# EAGLE design SERVOS-2 (EAGLE 7.2.0)
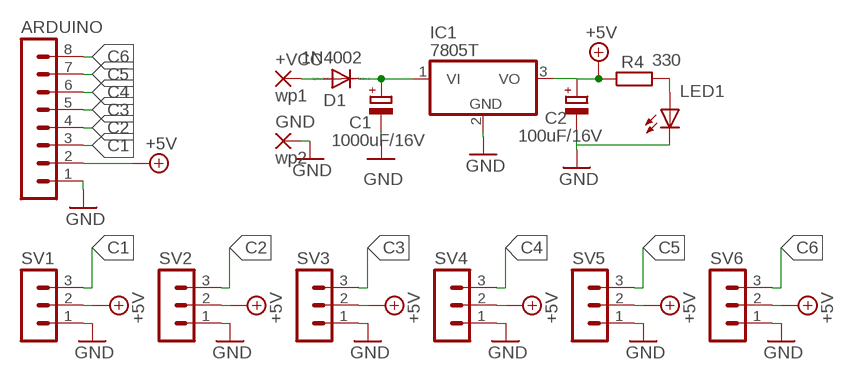
[diagram p0: schematic, sheet 1]

## Parts
+VCC  wp1  WIREPAD1,6/0,9  [1,6/0,9]
ARDUINO  MA08-1  [MA08-1]
C1  1000uF/16V  CPOL-EUE2.5-7  [E2,5-7]
C2  100uF/16V  CPOL-EUE2.5-5  [E2,5-5]
D1  1N4002  1N4148DO35-7  [DO35-7]
GND  wp2  WIREPAD1,6/0,9  [1,6/0,9]
IC1  7805T  [TO220H]
LED1  LED3MM  [LED3MM]
R4  330  R-EU_0207/10  [0207/10]
SV1  MA03-1  [MA03-1]
SV2  MA03-1  [MA03-1]
SV3  MA03-1  [MA03-1]
SV4  MA03-1  [MA03-1]
SV5  MA03-1  [MA03-1]
SV6  MA03-1  [MA03-1]

## Nets
+5V: ARDUINO.2 C2.+ IC1.3(VO) R4.1 SV1.2 SV2.2 SV3.2 SV4.2 SV5.2 SV6.2
C1: ARDUINO.3 SV1.3
C2: ARDUINO.4 SV2.3
C3: ARDUINO.5 SV3.3
C4: ARDUINO.6 SV4.3
C5: ARDUINO.7 SV5.3
C6: ARDUINO.8 SV6.3
GND: ARDUINO.1 C1.- C2.- GND.1(P) IC1.2(GND) LED1.K(C) SV1.1 SV2.1 SV3.1 SV4.1 SV5.1 SV6.1
N$1: C1.+ D1.C IC1.1(VI)
N$2: +VCC.1(P) D1.A
N$3: LED1.A R4.2

## Library data of the parts
+VCC GND = wirepad:WIREPAD: Wire PAD connect wire on PCB
ARDUINO = con-lstb:MA08-1: PIN HEADER; OC_FARNELL: unknown; OC_NEWARK: unknown
C1 C2 = rcl:CPOL-EU: POLARIZED CAPACITOR, European symbol
D1 = diode:1N4148: DIODE high speed (Philips)
IC1 = linear:78*: Positive VOLTAGE REGULATOR Source: http://cache.national.com/ds/LM/LM78L05.pdf http://www.fairchildsemi.com/ds/LM/LM7805.pdf
LED1 = led:LED: LED OSRAM: - CHIPLED LG R971, LG N971, LY N971, LG Q971, LY Q971, LO R971, LY R971 LH N974, LH R974 LS Q976, LO Q976, LY Q976 LO Q996 - Hyper CHIPLED LW Q18S LB Q993, LB Q99A, LB R99A - SideLED LS A670, LO A670, LY A670, LG A670, LP A670 LB A673, LV A673, LT A673, LW A673 LH A674 LY A675 LS A676, LA A676, LO A676, LY A676, LW A676 LS A679, LY A679, LG A679 - Hyper Micro SIDELED® LS Y876, LA Y876, LO Y876, LY Y876 LT Y87S - SmartLED LW L88C, LW L88S LB L89C, LB L89S, LG L890 LS L89K, LO L89K, LY L89K LS L896, LA L896, LO L896, LY L896 - TOPLED LS T670, LO T670, LY T670, LG T670, LP T670 LSG T670, LSP T670, LSY T670, LOP T670, LYG T670 LG T671, LOG T671, LSG T671 LB T673, LV T673, LT T673, LW T673 LH T674 LS T676, LA T676, LO T676, LY T676, LB T676, LH T676, LSB T676, LW T676 LB T67C, LV T67C, LT T67C, LS T67K, LO T67K, LY T67K, LW E67C LS E67B, LA E67B, LO E67B, LY E67B, LB E67C, LV E67C, LT E67C LW T67C LS T679, LY T679, LG T679 LS T770, LO T770, LY T770, LG T770, LP T770 LB T773, LV T773, LT T773, LW T773 LH T774 LS E675, LA E675, LY E675, LS T675 LS T776, LA T776, LO T776, LY T776, LB T776 LHGB T686 LT T68C, LB T68C - Hyper Mini TOPLED® LB M676 - Mini TOPLED Santana® LG M470 LS M47K, LO M47K, LY M47K Source: http://www.osram.convergy.de LUXEON: - LUMILED® LXK2-PW12-R00, LXK2-PW12-S00, LXK2-PW14-U00, LXK2-PW14-V00 LXK2-PM12-R00, LXK2-PM12-S00, LXK2-PM14-U00 LXK2-PE12-Q00, LXK2-PE12-R00, LXK2-PE12-S00, LXK2-PE14-T00, LXK2-PE14-U00 LXK2-PB12-K00, LXK2-PB12-L00, LXK2-PB12-M00, LXK2-PB14-N00, LXK2-PB14-P00, LXK2-PB14-Q00 LXK2-PR12-L00, LXK2-PR12-M00, LXK2-PR14-Q00, LXK2-PR14-R00 LXK2-PD12-Q00, LXK2-PD12-R00, LXK2-PD12-S00 LXK2-PH12-R00, LXK2-PH12-S00 LXK2-PL12-P00, LXK2-PL12-Q00, LXK2-PL12-R00 Source: www.luxeon.com KINGBRIGHT: KA-3528ASYC Source: www.kingbright.com
R4 = rcl:R-EU_: RESISTOR, European symbol
SV1-SV6 = con-lstb:MA03-1: PIN HEADER; OC_FARNELL: unknown; OC_NEWARK: unknown

## Board
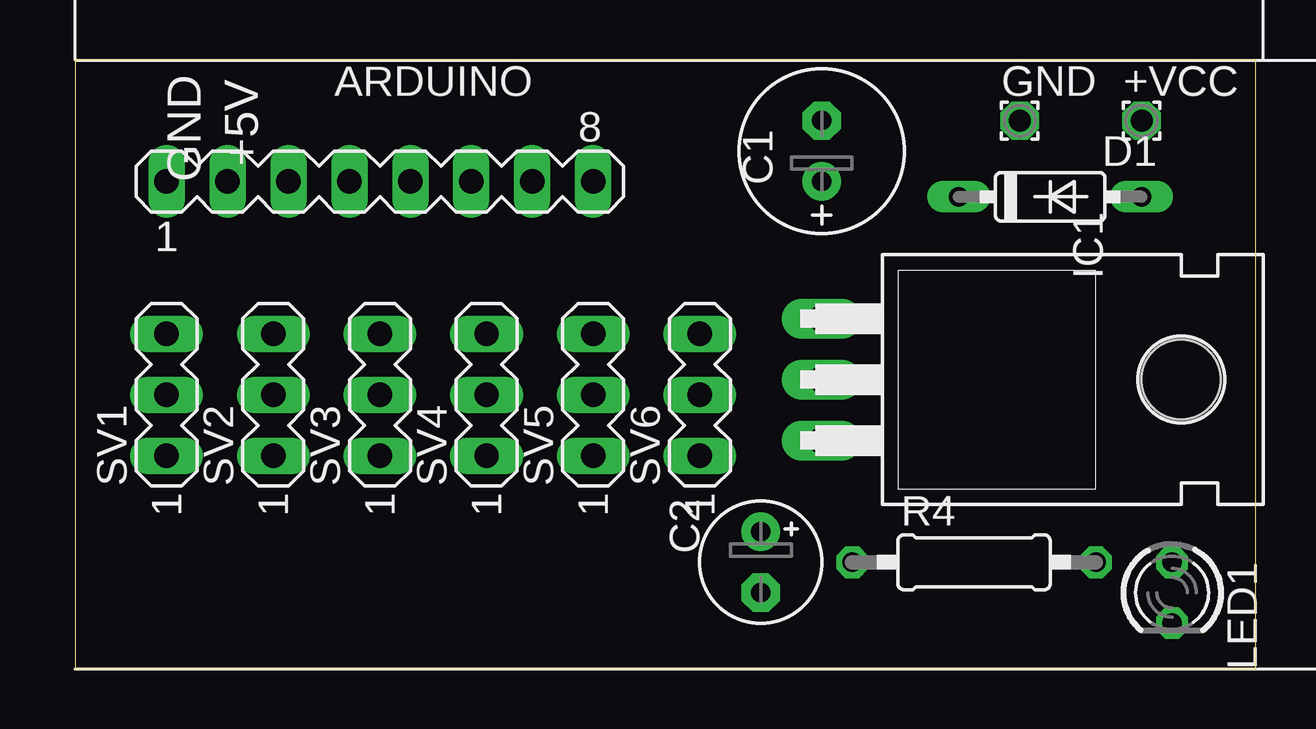
[diagram p1: board, top side]
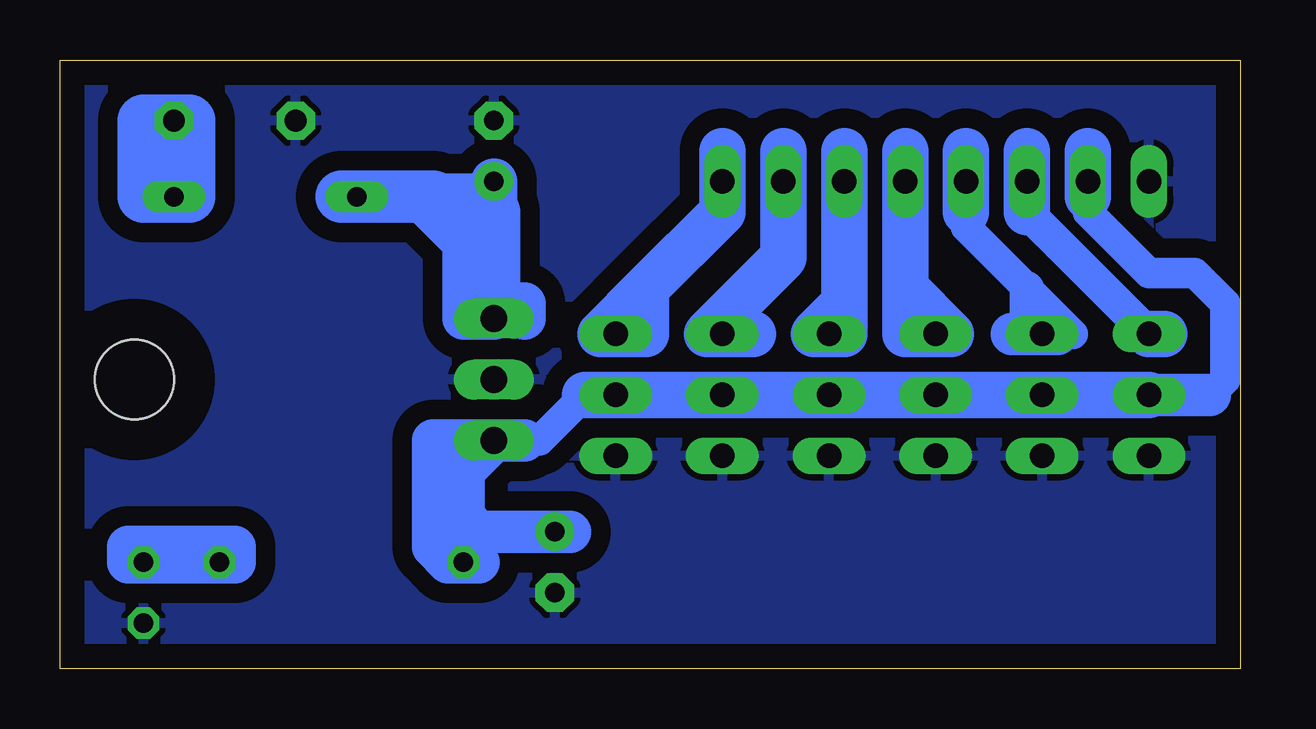
[diagram p2: board, bottom side, seen from below]

Size 49.2 x 25.39 mm. Coordinates in mm from the lower left corner, seen from the top.
Outline: 0,0 49.2,0 49.2,25.39 0,25.39 0,0
Copper layers (1*16): Top 0.035mm / dielectric 1.5mm / Bottom 0.035mm
Design rules "default": minimum track width 10mil, minimum drill 24mil, track to track 8mil, track to pad 8mil, pad to pad 8mil, via to via 8mil, smd to smd 8mil, copper to edge 40mil, drill to drill 8mil, minimum pad ring 10mil, minimum via ring 8mil, stop-mask expansion 4mil, vias tented up to drill 0mil, thermal gap 10mil

### Footprints (pad centres in the part's own frame; a part is rotated, then mirrored left to right if it is on the bottom)
1,6/0,9 = drill 0.914 pad 1.6 octagon: 1 0,0
MA08-1 = drill 1.016 long: 1 -8.89,0; 2 -6.35,0; 3 -3.81,0; 4 -1.27,0; 5 1.27,0; 6 3.81,0; 7 6.35,0; 8 8.89,0
E2,5-7 = drill 0.813 pad 1.6: + -1.27,0 | drill 0.813 pad 1.6 octagon: - 1.27,0
E2,5-5 = drill 0.813 pad 1.6: + -1.27,0 | drill 0.813 pad 1.6 octagon: - 1.27,0
DO35-7 = drill 0.813 long: A 3.81,0; C -3.81,0
TO220H = drill 1.118 long: 1 -2.54,-10.16; 2 0,-10.16; 3 2.54,-10.16 | hole 3.302: 0,4.826
LED3MM = drill 0.813 octagon: A -1.27,0; K 1.27,0
0207/10 = drill 0.813 octagon: 1 -5.08,0; 2 5.08,0
MA03-1 = drill 1.016 long: 1 -2.54,0; 2 0,0; 3 2.54,0

### Placement (x,y rotation side)
+VCC  44.45,22.86 0 top
ARDUINO  12.7,20.32 0 top
C1  31.12,21.59 90 top
C2  28.58,4.45 270 top
D1  40.64,19.69 0 top
GND  39.37,22.86 0 top
IC1  41.27,12.06 270 top
LED1  45.72,3.18 270 top
R4  37.47,4.45 0 top
SV1  3.81,11.43 90 top
SV2  8.26,11.43 90 top
SV3  12.7,11.43 90 top
SV4  17.14,11.43 90 top
SV5  21.59,11.43 90 top
SV6  26.04,11.43 90 top

### Tracks (layer width: path | path; a pad name or v marks a point on that pad's centre or on a via)
+5V
  Bottom 1.27: 29.84,9.52 29.21,9.52 27.3,11.43 | 6.35,19.69 6.35,19.05 3.81,16.51 1.9,16.51 0.63,15.24 0.63,12.06 1.27,11.43
  Bottom 1.778: IC1.3 31.75,9.52 33.02,9.52 | 33.02,9.52 33.02,5.71 | IC1.3 29.84,9.52 | 1.27,11.43 SV1.2 | 27.94,5.71 C2.+ 31.75,5.71 32.38,6.35 32.38,8.26 IC1.3 | 31.75,4.45 R4.1 33.02,4.45 33.66,5.08 33.66,9.52 33.02,9.52
  Bottom 1.93: 27.3,11.43 SV6.2 SV5.2 SV4.2 SV3.2 SV2.2 SV1.2 | 6.35,21.59 ARDUINO.2 6.35,19.69
C1
  Bottom 1.422: SV1.3 8.89,19.05
  Bottom 1.93: SV1.3 3.17,13.97 | 8.89,19.05 ARDUINO.3 8.89,21.59
C2
  Bottom 1.27: 11.43,19.05 11.43,18.41 8.89,15.88 6.98,13.97
  Bottom 1.422: 7.62,13.97 8.89,13.97 8.89,15.88
  Bottom 1.778: 9.53,13.97 8.89,13.97 SV2.3 7.62,13.97
  Bottom 1.93: 11.43,21.59 ARDUINO.4 11.43,19.05
C3
  Bottom 1.93: 13.97,21.59 ARDUINO.5 13.97,15.88 | 13.97,15.88 12.06,13.97 SV3.3 | SV3.3 13.97,13.97 13.97,15.24 | 13.97,15.88 13.97,15.24 | 13.97,15.24 SV3.3
C4
  Bottom 1.93: 16.51,21.59 ARDUINO.6 16.51,15.24 | 16.51,14.6 16.51,13.97 SV4.3 | SV4.3 17.78,13.97 16.51,15.24 | 16.51,15.24 16.51,14.6 | 16.51,14.6 SV4.3
C5
  Bottom 1.93: 20.32,13.97 SV5.3 22.23,13.97 19.05,17.14 ARDUINO.7 19.05,21.59
C6
  Bottom 1.93: 21.59,21.59 ARDUINO.8 21.59,19.05 24.77,15.88 | 24.77,15.88 26.67,13.97 SV6.3 | SV6.3 24.77,13.97 24.77,15.24 | 24.77,15.88 24.77,15.24 | 24.77,15.24 SV6.3
GND
  pour Bottom (isolate 0.813): 0,0 49.53,0 49.53,25.4 0,25.4
N$1
  Bottom 1.778: 31.12,15.24 29.84,15.24 29.84,14.6 | IC1.1 32.38,14.6 32.38,17.78 34.29,19.69
  Bottom 1.93: 33.66,19.69 31.12,19.69 C1.+ 31.12,19.05
  Bottom 2.184: 37.47,19.69 D1.C 34.29,19.69 33.66,19.69 | 31.12,19.05 31.12,15.24
N$2
  Bottom 2.184: +VCC.1 43.81,22.86 43.81,19.69 D1.A | D1.A 45.72,19.69 45.72,22.86 +VCC.1 | +VCC.1 D1.A
N$3
  Bottom 1.778: R4.2 41.91,4.45 41.91,5.08 46.36,5.08 46.36,4.45 LED1.A R4.2

### Text on the board
tNames: GND | +5V